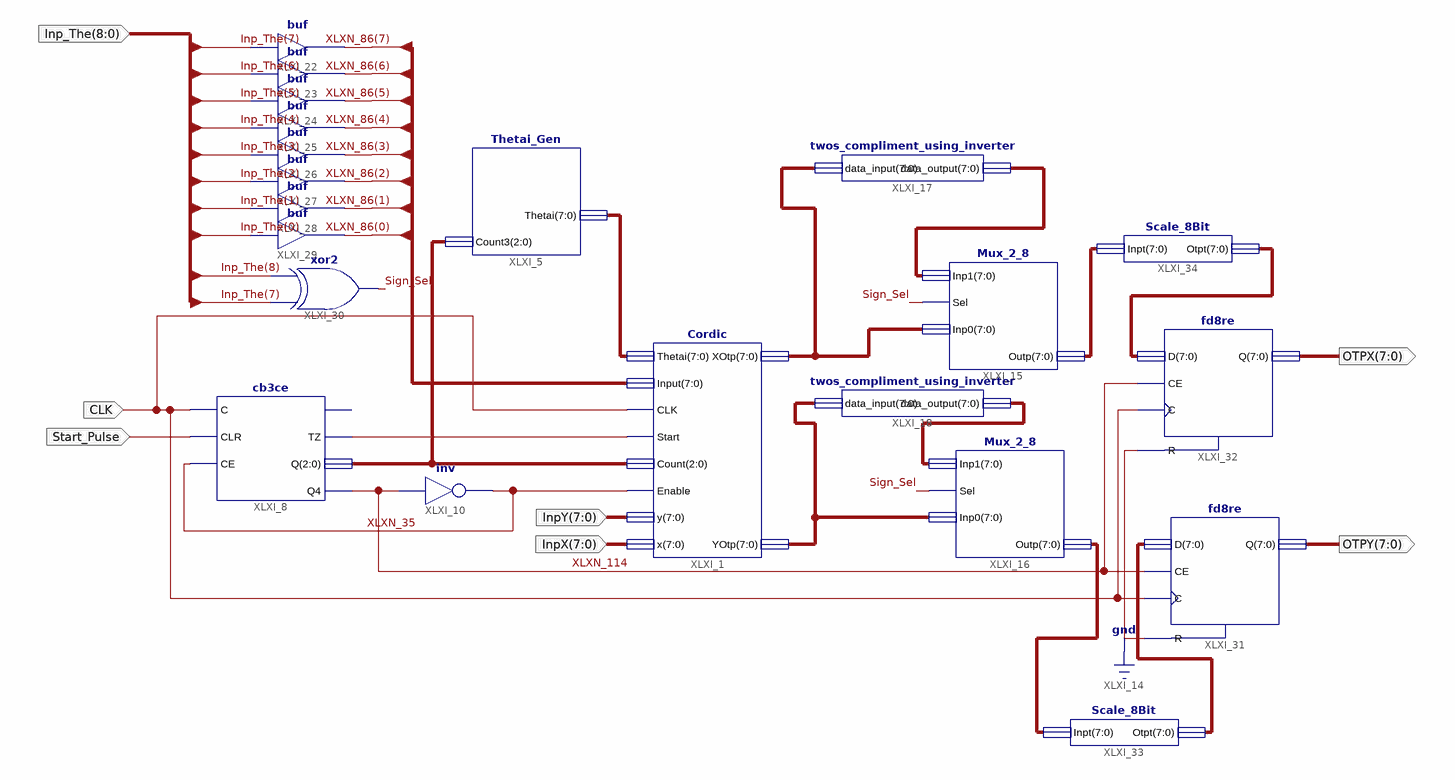
[diagram p0: schematic sheet 1]
// Xilinx ISE schematic Main.sch (spartan3e) as structural Verilog: 21 symbols, 7 ports
module Main (
  input  CLK,
  input  [8:0] Inp_The,
  input  [7:0] InpY,
  input  [7:0] InpX,
  input  Start_Pulse,
  output [7:0] OTPX,
  output [7:0] OTPY
);

  wire Sign_Sel, XLXN_8, XLXN_35, XLXN_114;
  wire [2:0] XLXN_1;
  wire [7:0] XLXN_3, XLXN_55, XLXN_56, XLXN_58, XLXN_59, XLXN_86, XLXN_117, XLXN_118, XLXN_119, XLXN_121;

  Cordic XLXI_1 (
    .Thetai(XLXN_3), .Input(XLXN_86), .CLK(CLK), .Start(XLXN_8), .Count(XLXN_1), .Enable(XLXN_35), .y(InpY),
    .x(InpX), .XOtp(XLXN_58), .YOtp(XLXN_59));
  Thetai_Gen XLXI_5 (.Thetai(XLXN_3), .Count3(XLXN_1));
  cb3ce XLXI_8 (.C(CLK), .CLR(Start_Pulse), .CE(XLXN_35), .Q(XLXN_1), .Q4(XLXN_114), .TZ(XLXN_8));  // open: CEO
  not XLXI_10 (XLXN_35, XLXN_114);
  Mux_2_8 XLXI_15 (.Inp1(XLXN_56), .Sel(Sign_Sel), .Inp0(XLXN_58), .Outp(XLXN_117));
  Mux_2_8 XLXI_16 (.Inp1(XLXN_55), .Sel(Sign_Sel), .Inp0(XLXN_59), .Outp(XLXN_119));
  twos_compliment_using_inverter XLXI_17 (.data_input(XLXN_58), .data_output(XLXN_56));
  twos_compliment_using_inverter XLXI_18 (.data_input(XLXN_59), .data_output(XLXN_55));
  buf XLXI_22 (XLXN_86[7], Inp_The[7]);
  buf XLXI_23 (XLXN_86[6], Inp_The[6]);
  buf XLXI_24 (XLXN_86[5], Inp_The[5]);
  buf XLXI_25 (XLXN_86[4], Inp_The[4]);
  buf XLXI_26 (XLXN_86[3], Inp_The[3]);
  buf XLXI_27 (XLXN_86[2], Inp_The[2]);
  buf XLXI_28 (XLXN_86[1], Inp_The[1]);
  buf XLXI_29 (XLXN_86[0], Inp_The[0]);
  xor XLXI_30 (Sign_Sel, Inp_The[7], Inp_The[8]);
  fd8re XLXI_31 (.C(CLK), .CE(XLXN_114), .D(XLXN_121), .R(1'b0), .Q(OTPY));
  fd8re XLXI_32 (.C(CLK), .CE(XLXN_114), .D(XLXN_118), .R(1'b0), .Q(OTPX));
  Scale_8Bit XLXI_33 (.Inpt(XLXN_119), .Otpt(XLXN_121));
  Scale_8Bit XLXI_34 (.Inpt(XLXN_117), .Otpt(XLXN_118));
endmodule
